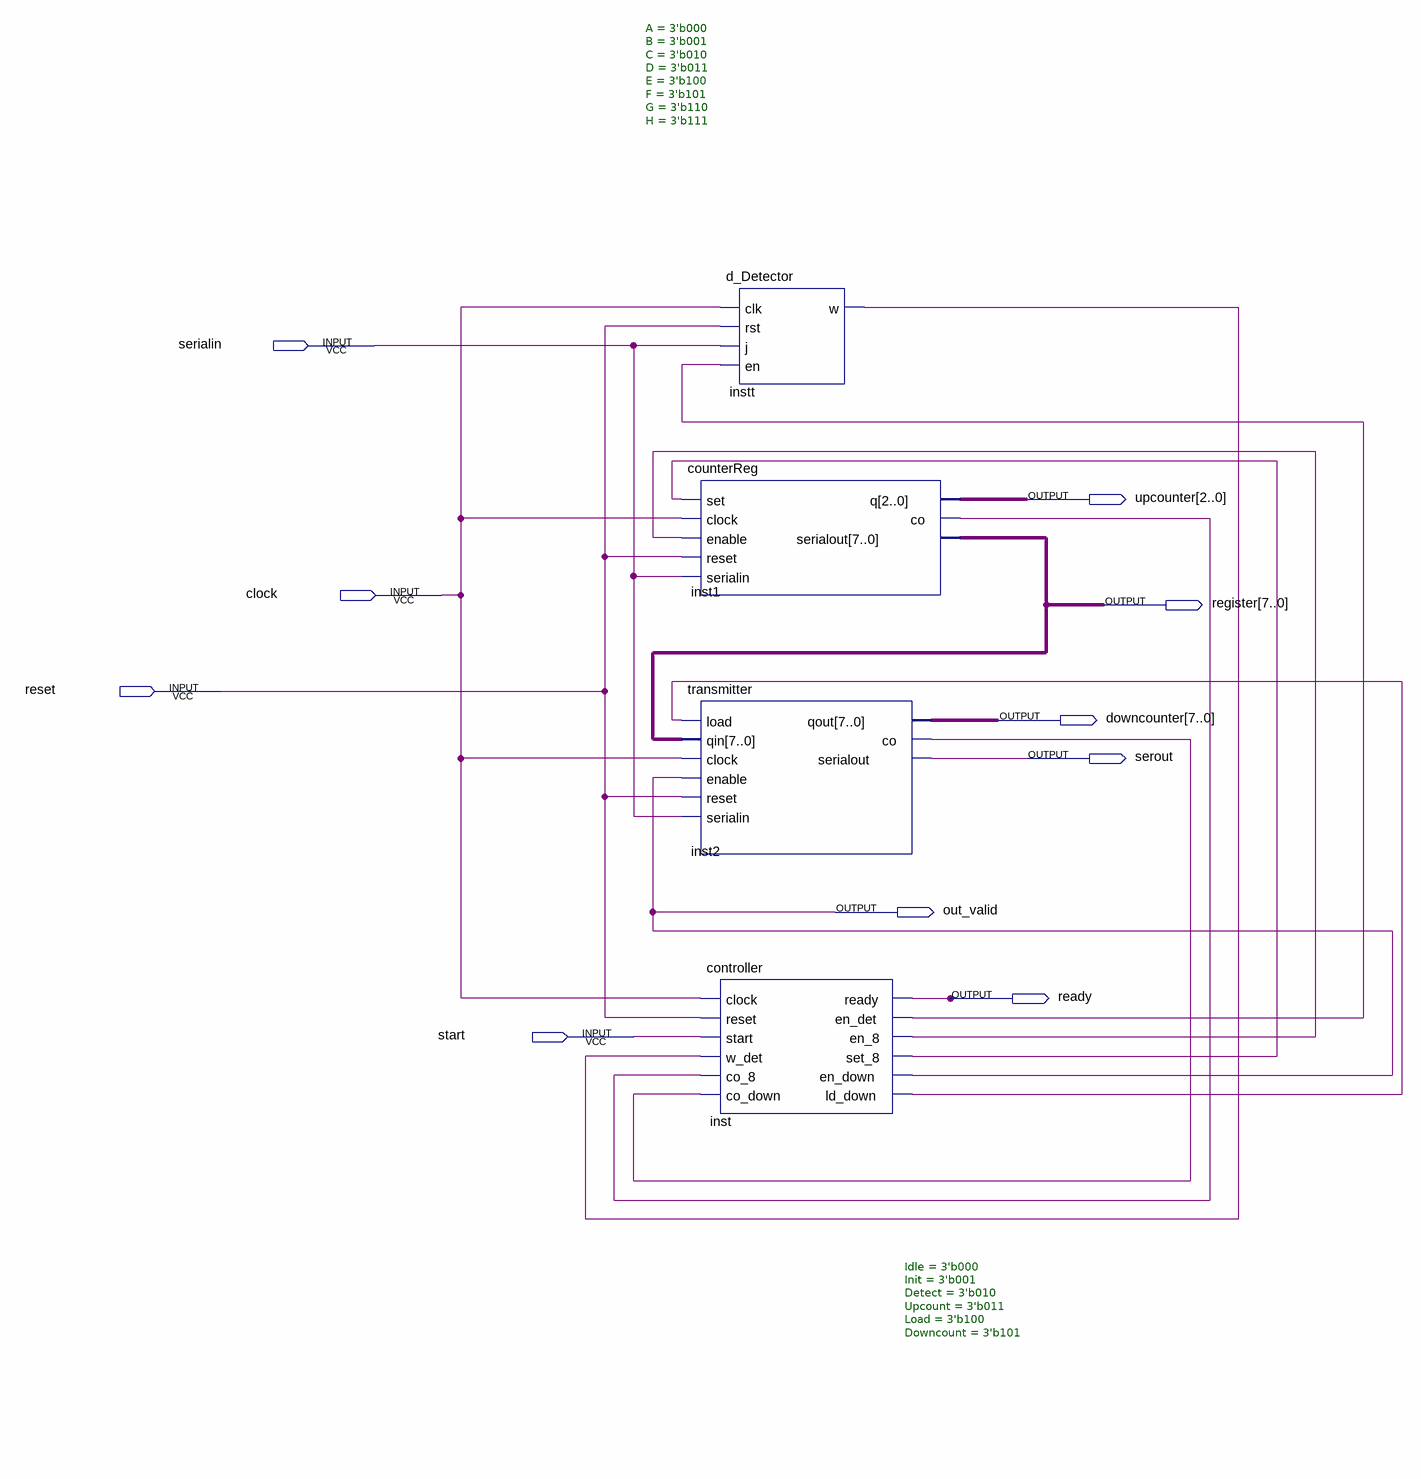
[diagram p0: schematic sheet]
// Quartus schematic serial_transmitter_circuit.bdf as structural Verilog: 4 symbols, 10 pins
module serial_transmitter_circuit (
  input  serialin,
  input  clock,
  input  reset,
  input  start,
  output [2:0] upcounter,
  output [7:0] register,
  output [7:0] downcounter,
  output serout,
  output out_valid,
  output ready
);

  wire inst1_co, inst2_co, inst_en_8, inst_en_det, inst_ld_down, inst_set_8, instt_w;

  counterReg inst1 (
    .set(inst_set_8), .clock(clock), .enable(inst_en_8), .reset(reset), .serialin(serialin), .q(upcounter),
    .co(inst1_co), .serialout(register));
  transmitter inst2 (
    .load(inst_ld_down), .qin(register), .clock(clock), .enable(out_valid), .reset(reset),
    .serialin(serialin), .qout(downcounter), .co(inst2_co), .serialout(serout));
  controller #(.Idle(3'b000), .Init(3'b001), .Detect(3'b010), .Upcount(3'b011), .Load(3'b100), .Downcount(3'b101)) inst (
    .clock(clock), .reset(reset), .start(start), .w_det(instt_w), .co_8(inst1_co), .co_down(inst2_co),
    .ready(ready), .en_det(inst_en_det), .en_8(inst_en_8), .set_8(inst_set_8), .en_down(out_valid),
    .ld_down(inst_ld_down));
  d_Detector #(.A(3'b000), .B(3'b001), .C(3'b010), .D(3'b011), .E(3'b100), .F(3'b101), .G(3'b110), .H(3'b111)) instt (
    .clk(clock), .rst(reset), .j(serialin), .en(inst_en_det), .w(instt_w));
endmodule
